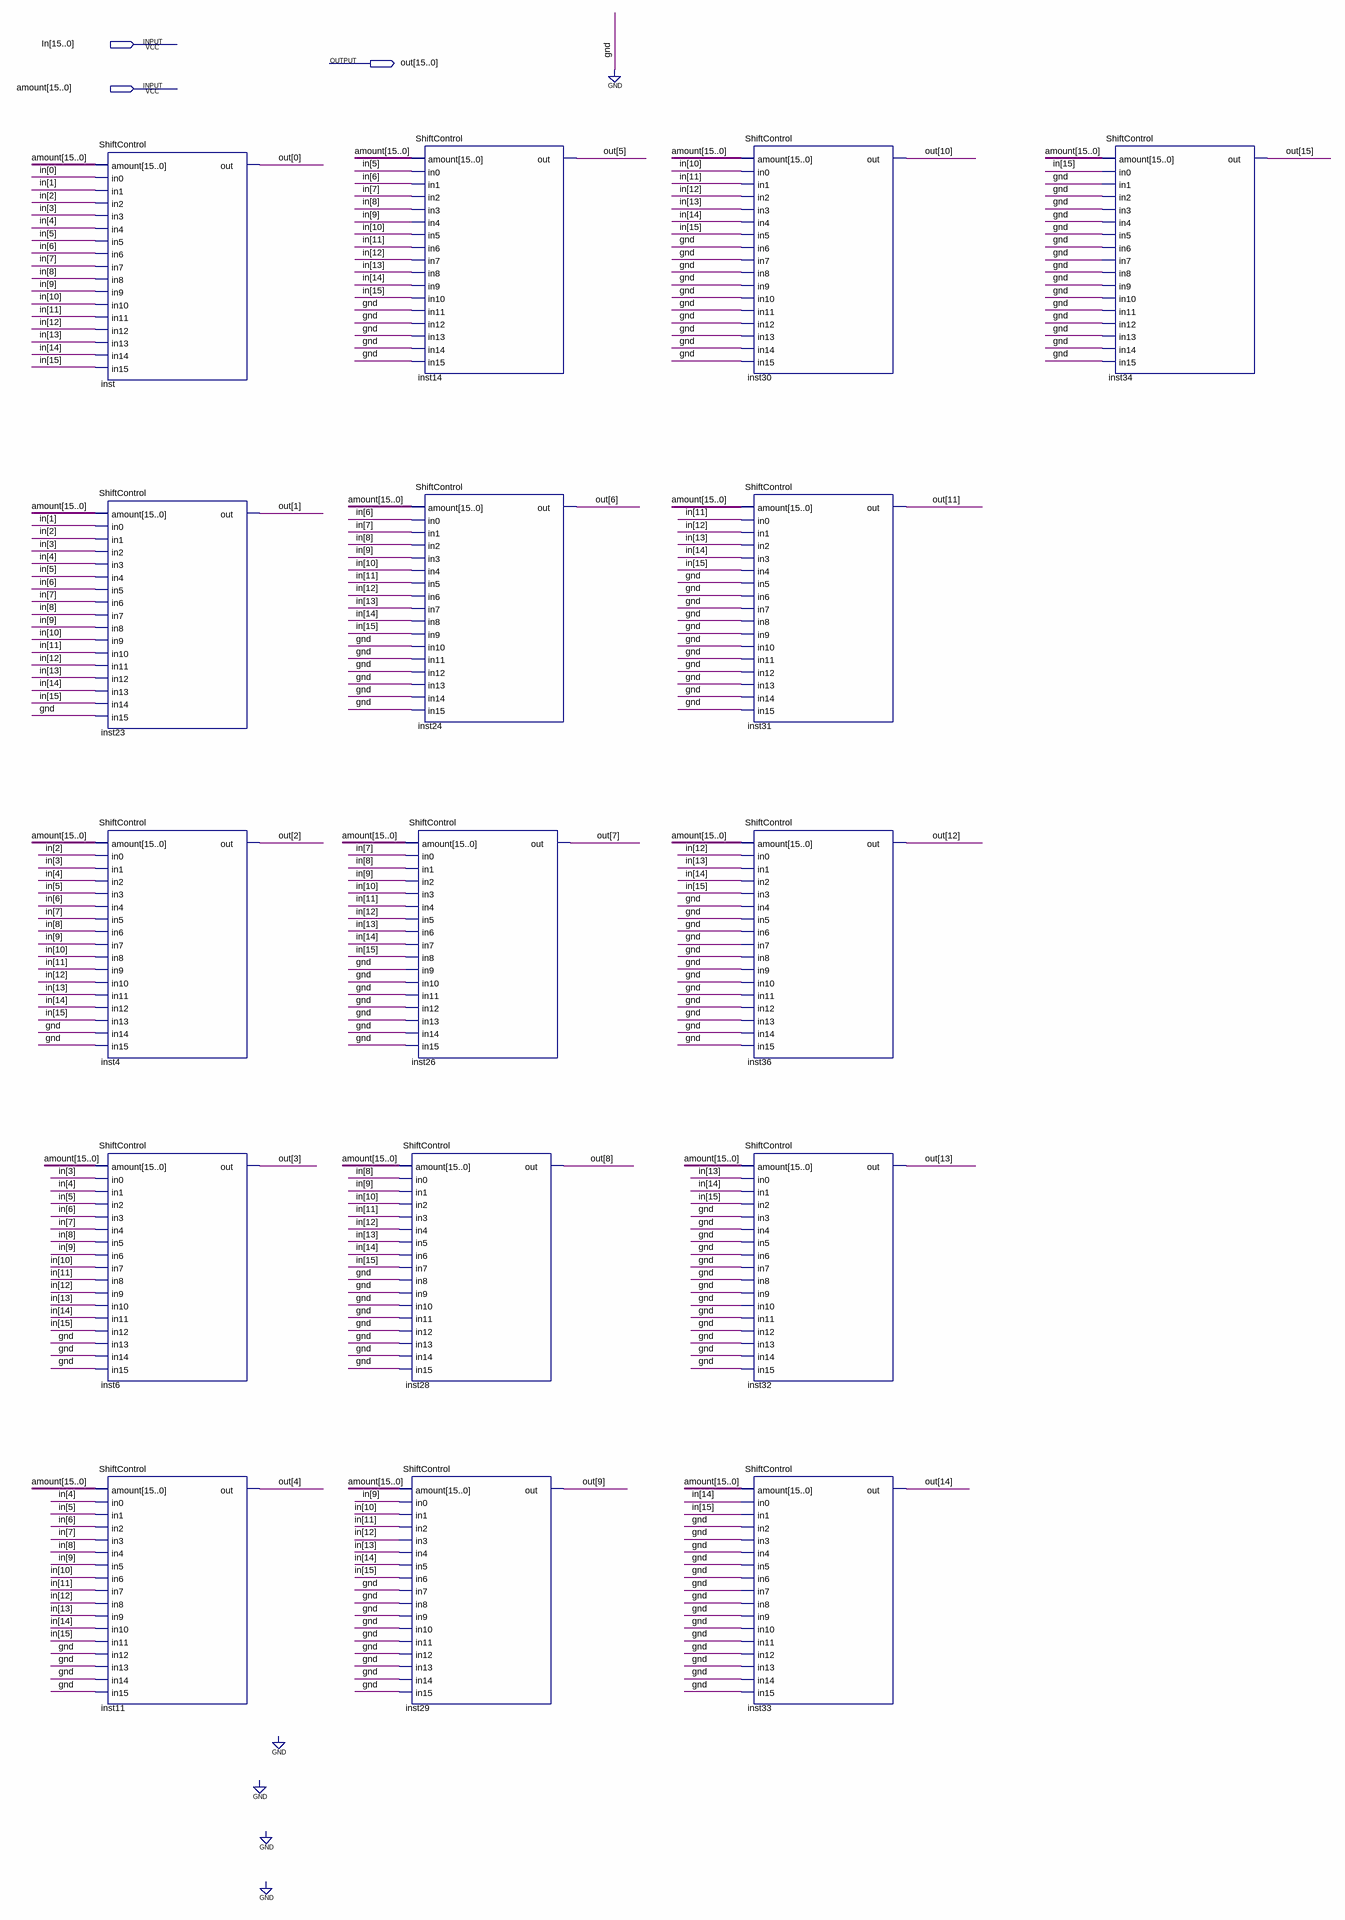
[diagram p0: schematic sheet]
// Quartus schematic ShiftRight16.bdf as structural Verilog: 16 symbols, 3 pins
module ShiftRight16 (
  input  [15:0] In,
  input  [15:0] amount,
  output [15:0] out
);

  ShiftControl inst (
    .amount(amount), .in0(In[0]), .in1(In[1]), .in2(In[2]), .in3(In[3]), .in4(In[4]), .in5(In[5]),
    .in6(In[6]), .in7(In[7]), .in8(In[8]), .in9(In[9]), .in10(In[10]), .in11(In[11]), .in12(In[12]),
    .in13(In[13]), .in14(In[14]), .in15(In[15]), .out(out[0]));
  ShiftControl inst23 (
    .amount(amount), .in0(In[1]), .in1(In[2]), .in2(In[3]), .in3(In[4]), .in4(In[5]), .in5(In[6]),
    .in6(In[7]), .in7(In[8]), .in8(In[9]), .in9(In[10]), .in10(In[11]), .in11(In[12]), .in12(In[13]),
    .in13(In[14]), .in14(In[15]), .in15(1'b0), .out(out[1]));
  ShiftControl inst4 (
    .amount(amount), .in0(In[2]), .in1(In[3]), .in2(In[4]), .in3(In[5]), .in4(In[6]), .in5(In[7]),
    .in6(In[8]), .in7(In[9]), .in8(In[10]), .in9(In[11]), .in10(In[12]), .in11(In[13]), .in12(In[14]),
    .in13(In[15]), .in14(1'b0), .in15(1'b0), .out(out[2]));
  ShiftControl inst6 (
    .amount(amount), .in0(In[3]), .in1(In[4]), .in2(In[5]), .in3(In[6]), .in4(In[7]), .in5(In[8]),
    .in6(In[9]), .in7(In[10]), .in8(In[11]), .in9(In[12]), .in10(In[13]), .in11(In[14]), .in12(In[15]),
    .in13(1'b0), .in14(1'b0), .in15(1'b0), .out(out[3]));
  ShiftControl inst11 (
    .amount(amount), .in0(In[4]), .in1(In[5]), .in2(In[6]), .in3(In[7]), .in4(In[8]), .in5(In[9]),
    .in6(In[10]), .in7(In[11]), .in8(In[12]), .in9(In[13]), .in10(In[14]), .in11(In[15]), .in12(1'b0),
    .in13(1'b0), .in14(1'b0), .in15(1'b0), .out(out[4]));
  ShiftControl inst14 (
    .amount(amount), .in0(In[5]), .in1(In[6]), .in2(In[7]), .in3(In[8]), .in4(In[9]), .in5(In[10]),
    .in6(In[11]), .in7(In[12]), .in8(In[13]), .in9(In[14]), .in10(In[15]), .in11(1'b0), .in12(1'b0),
    .in13(1'b0), .in14(1'b0), .in15(1'b0), .out(out[5]));
  ShiftControl inst24 (
    .amount(amount), .in0(In[6]), .in1(In[7]), .in2(In[8]), .in3(In[9]), .in4(In[10]), .in5(In[11]),
    .in6(In[12]), .in7(In[13]), .in8(In[14]), .in9(In[15]), .in10(1'b0), .in11(1'b0), .in12(1'b0),
    .in13(1'b0), .in14(1'b0), .in15(1'b0), .out(out[6]));
  ShiftControl inst26 (
    .amount(amount), .in0(In[7]), .in1(In[8]), .in2(In[9]), .in3(In[10]), .in4(In[11]), .in5(In[12]),
    .in6(In[13]), .in7(In[14]), .in8(In[15]), .in9(1'b0), .in10(1'b0), .in11(1'b0), .in12(1'b0), .in13(1'b0),
    .in14(1'b0), .in15(1'b0), .out(out[7]));
  ShiftControl inst28 (
    .amount(amount), .in0(In[8]), .in1(In[9]), .in2(In[10]), .in3(In[11]), .in4(In[12]), .in5(In[13]),
    .in6(In[14]), .in7(In[15]), .in8(1'b0), .in9(1'b0), .in10(1'b0), .in11(1'b0), .in12(1'b0), .in13(1'b0),
    .in14(1'b0), .in15(1'b0), .out(out[8]));
  ShiftControl inst29 (
    .amount(amount), .in0(In[9]), .in1(In[10]), .in2(In[11]), .in3(In[12]), .in4(In[13]), .in5(In[14]),
    .in6(In[15]), .in7(1'b0), .in8(1'b0), .in9(1'b0), .in10(1'b0), .in11(1'b0), .in12(1'b0), .in13(1'b0),
    .in14(1'b0), .in15(1'b0), .out(out[9]));
  ShiftControl inst30 (
    .amount(amount), .in0(In[10]), .in1(In[11]), .in2(In[12]), .in3(In[13]), .in4(In[14]), .in5(In[15]),
    .in6(1'b0), .in7(1'b0), .in8(1'b0), .in9(1'b0), .in10(1'b0), .in11(1'b0), .in12(1'b0), .in13(1'b0),
    .in14(1'b0), .in15(1'b0), .out(out[10]));
  ShiftControl inst31 (
    .amount(amount), .in0(In[11]), .in1(In[12]), .in2(In[13]), .in3(In[14]), .in4(In[15]), .in5(1'b0),
    .in6(1'b0), .in7(1'b0), .in8(1'b0), .in9(1'b0), .in10(1'b0), .in11(1'b0), .in12(1'b0), .in13(1'b0),
    .in14(1'b0), .in15(1'b0), .out(out[11]));
  ShiftControl inst36 (
    .amount(amount), .in0(In[12]), .in1(In[13]), .in2(In[14]), .in3(In[15]), .in4(1'b0), .in5(1'b0),
    .in6(1'b0), .in7(1'b0), .in8(1'b0), .in9(1'b0), .in10(1'b0), .in11(1'b0), .in12(1'b0), .in13(1'b0),
    .in14(1'b0), .in15(1'b0), .out(out[12]));
  ShiftControl inst32 (
    .amount(amount), .in0(In[13]), .in1(In[14]), .in2(In[15]), .in3(1'b0), .in4(1'b0), .in5(1'b0),
    .in6(1'b0), .in7(1'b0), .in8(1'b0), .in9(1'b0), .in10(1'b0), .in11(1'b0), .in12(1'b0), .in13(1'b0),
    .in14(1'b0), .in15(1'b0), .out(out[13]));
  ShiftControl inst33 (
    .amount(amount), .in0(In[14]), .in1(In[15]), .in2(1'b0), .in3(1'b0), .in4(1'b0), .in5(1'b0), .in6(1'b0),
    .in7(1'b0), .in8(1'b0), .in9(1'b0), .in10(1'b0), .in11(1'b0), .in12(1'b0), .in13(1'b0), .in14(1'b0),
    .in15(1'b0), .out(out[14]));
  ShiftControl inst34 (
    .amount(amount), .in0(In[15]), .in1(1'b0), .in2(1'b0), .in3(1'b0), .in4(1'b0), .in5(1'b0), .in6(1'b0),
    .in7(1'b0), .in8(1'b0), .in9(1'b0), .in10(1'b0), .in11(1'b0), .in12(1'b0), .in13(1'b0), .in14(1'b0),
    .in15(1'b0), .out(out[15]));
endmodule
